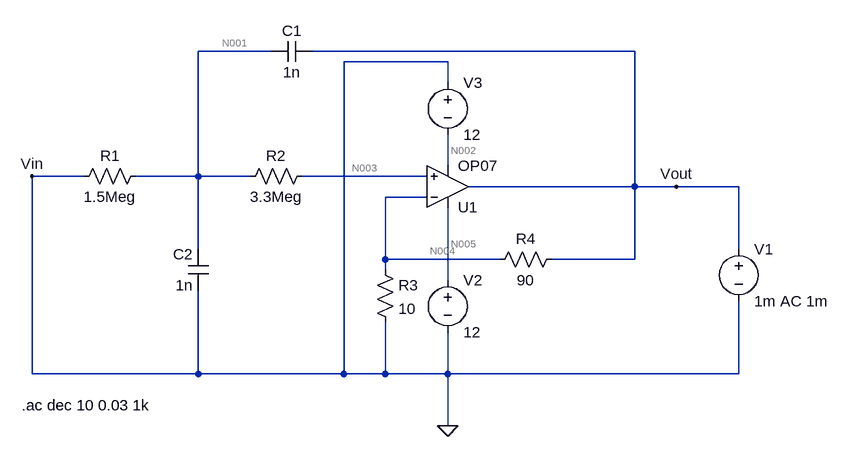
[diagram p0: schematic LF - ro.asc]
LF - ro.asc, the LTspice schematic file:
Version 4.1
SHEET 1 1216 680
WIRE 352 -96 240 -96
WIRE 912 -96 416 -96
WIRE 624 -80 464 -80
WIRE 624 -48 624 -80
WIRE 624 80 624 32
WIRE 64 96 -16 96
WIRE 240 96 240 -96
WIRE 240 96 144 96
WIRE 320 96 240 96
WIRE 592 96 400 96
WIRE 912 112 912 -96
WIRE 912 112 656 112
WIRE 976 112 912 112
WIRE 1072 112 976 112
WIRE 592 128 528 128
WIRE 240 208 240 96
WIRE 1072 208 1072 112
WIRE 528 224 528 128
WIRE 704 224 528 224
WIRE 912 224 912 112
WIRE 912 224 784 224
WIRE 528 240 528 224
WIRE 624 256 624 144
WIRE -16 400 -16 96
WIRE 240 400 240 272
WIRE 240 400 -16 400
WIRE 464 400 464 -80
WIRE 464 400 240 400
WIRE 528 400 528 320
WIRE 528 400 464 400
WIRE 624 400 624 336
WIRE 624 400 528 400
WIRE 1072 400 1072 288
WIRE 1072 400 624 400
WIRE 624 480 624 400
FLAG 624 480 0
FLAG -16 96 Vin
FLAG 976 112 Vout
SYMBOL res 160 80 R90
WINDOW 0 0 56 VBottom 2
WINDOW 3 32 56 VTop 2
SYMATTR InstName R1
SYMATTR Value 1.5Meg
SYMBOL res 416 80 R90
WINDOW 0 0 56 VBottom 2
WINDOW 3 32 56 VTop 2
SYMATTR InstName R2
SYMATTR Value 3.3Meg
SYMBOL res 512 224 R0
SYMATTR InstName R3
SYMATTR Value 10
SYMBOL cap 416 -112 R90
WINDOW 0 0 32 VBottom 2
WINDOW 3 32 32 VTop 2
SYMATTR InstName C1
SYMATTR Value 1n
SYMBOL cap 256 272 R180
WINDOW 0 24 56 Left 2
WINDOW 3 24 8 Left 2
SYMATTR InstName C2
SYMATTR Value 1n
SYMBOL res 800 208 R90
WINDOW 0 0 56 VBottom 2
WINDOW 3 32 56 VTop 2
SYMATTR InstName R4
SYMATTR Value 90
SYMBOL OpAmps\\OP07 624 176 M180
SYMATTR InstName U1
SYMBOL voltage 624 240 R0
SYMATTR InstName V2
SYMATTR Value 12
SYMBOL voltage 624 -64 R0
SYMATTR InstName V3
SYMATTR Value 12
SYMBOL voltage 1072 192 R0
SYMATTR InstName V1
SYMATTR Value 1m AC 1m
TEXT -32 448 Left 2 !.ac dec 10 0.03 1k

The netlist it stands for:
* LF - ro.asc
R1 N001 0 1.5Meg
R2 N003 N001 3.3Meg
R3 N004 0 10
C1 Vout N001 1n
C2 0 N001 1n
R4 Vout N004 90
X§U1 N003 N004 N005 N002 Vout LT1001  ; OP07, pins In+ In- V+ V- OUT
V2 N005 0 12
V3 0 N002 12
V1 Vout 0 1m AC 1m
.ac dec 10 0.03 1k
.lib LTC.lib
.backanno
.end

* Results of the author's LTspice run, read from the files saved beside the schematic
* Operating Point, zero values left out:
*   V(n001) = 1.902 µV
*   V(n002) = -12 V
*   V(n003) = 6.086 µV
*   V(n004) = 100 µV
*   V(n005) = 12 V
*   V(vout) = 1 mV
*   I(R1) = 1.268 pA
*   I(R2) = 1.268 pA
*   I(R3) = 10 µA
*   I(R4) = 10 µA
*   I(V1) = -31.67 mA
*   I(V2) = -1.328 nA
*   I(V3) = -31.66 mA
*   Ix(u1:1) = -1.268 pA
*   Ix(u1:2) = 1.268 pA
*   Ix(u1:3) = 1.316 nA
*   Ix(u1:4) = -31.66 mA
*   Ix(u1:5) = 31.66 mA
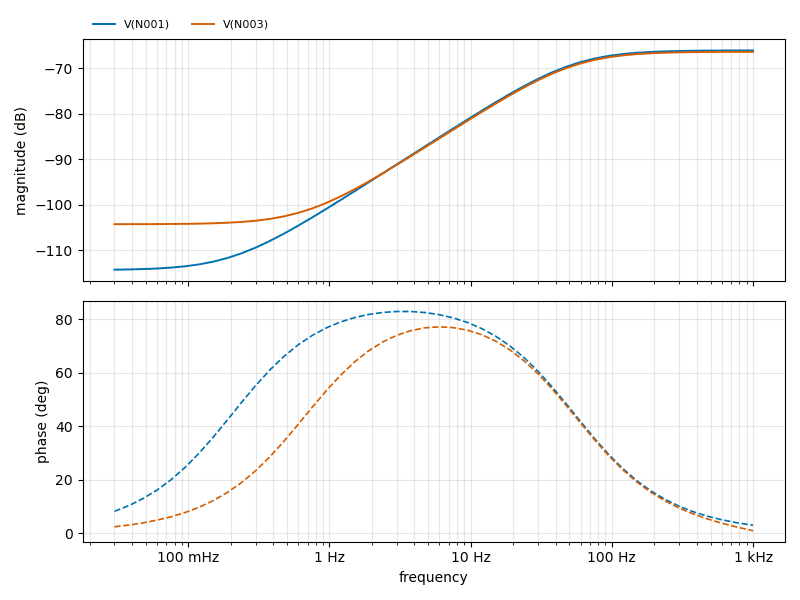
[diagram p1: AC Analysis of LF - ro.asc, plotted from the saved traces]
* AC Analysis, 1 run:
*   V(N001): -114.33 dB at 30 mHz, -66.04 dB at 1 kHz, peak -66.04 dB at 1 kHz, 3 dB below the peak at 54.22 Hz
*   V(N003): -104.31 dB at 30 mHz, -66.35 dB at 1 kHz, peak -66.35 dB at 1 kHz, 3 dB below the peak at 54.13 Hz